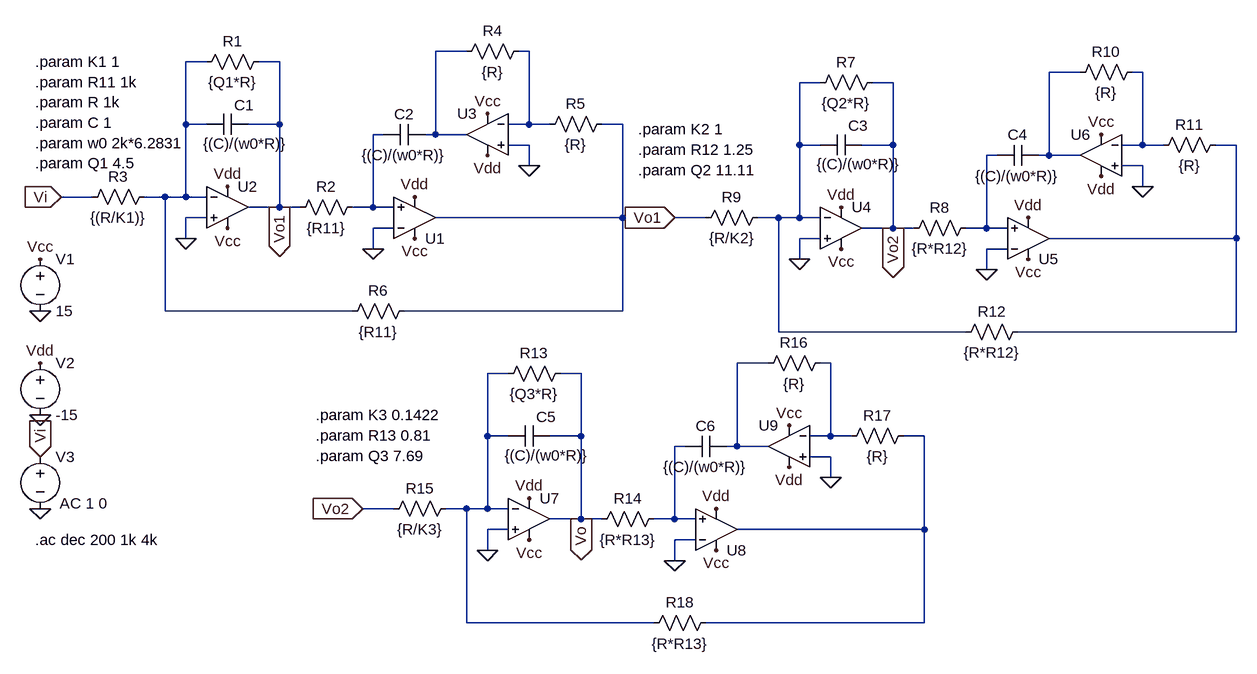
[diagram p0: schematic problema#2_9.asc]
problema#2_9.asc, the LTspice schematic file:
Version 4
SHEET 1 1264 1456
WIRE -512 -16 -560 -16
WIRE -416 -16 -432 -16
WIRE -912 0 -944 0
WIRE -800 0 -832 0
WIRE 432 16 384 16
WIRE 528 16 512 16
WIRE 32 32 0 32
WIRE 144 32 112 32
WIRE -944 96 -944 0
WIRE -912 96 -944 96
WIRE -800 96 -800 0
WIRE -800 96 -848 96
WIRE -416 96 -416 -16
WIRE -416 96 -448 96
WIRE -384 96 -416 96
WIRE -272 96 -304 96
WIRE -640 112 -656 112
WIRE -560 112 -560 -16
WIRE -560 112 -576 112
WIRE -512 112 -560 112
WIRE -416 128 -448 128
WIRE 0 128 0 32
WIRE 32 128 0 128
WIRE 144 128 144 32
WIRE 144 128 96 128
WIRE 528 128 528 16
WIRE 528 128 496 128
WIRE 560 128 528 128
WIRE 672 128 640 128
WIRE 304 144 288 144
WIRE 384 144 384 16
WIRE 384 144 368 144
WIRE 432 144 384 144
WIRE -416 160 -416 128
WIRE 528 160 496 160
WIRE 528 192 528 160
WIRE -1088 208 -1136 208
WIRE -976 208 -1008 208
WIRE -944 208 -944 96
WIRE -944 208 -976 208
WIRE -912 208 -944 208
WIRE -800 224 -800 96
WIRE -800 224 -848 224
WIRE -768 224 -800 224
WIRE -656 224 -656 112
WIRE -656 224 -688 224
WIRE -624 224 -656 224
WIRE -912 240 -944 240
WIRE -272 240 -272 96
WIRE -272 240 -560 240
WIRE -144 240 -192 240
WIRE -32 240 -64 240
WIRE 0 240 0 128
WIRE 0 240 -32 240
WIRE 32 240 0 240
WIRE -624 256 -656 256
WIRE 144 256 144 128
WIRE 144 256 96 256
WIRE 176 256 144 256
WIRE 288 256 288 144
WIRE 288 256 256 256
WIRE 320 256 288 256
WIRE -944 272 -944 240
WIRE 32 272 0 272
WIRE 672 272 672 128
WIRE 672 272 384 272
WIRE -656 288 -656 256
WIRE 320 288 288 288
WIRE 0 304 0 272
WIRE 288 320 288 288
WIRE -976 384 -976 208
WIRE -688 384 -976 384
WIRE -272 384 -272 240
WIRE -272 384 -608 384
WIRE -32 416 -32 240
WIRE 256 416 -32 416
WIRE 672 416 672 272
WIRE 672 416 336 416
WIRE -48 464 -96 464
WIRE 48 464 32 464
WIRE -448 480 -480 480
WIRE -336 480 -368 480
WIRE -480 576 -480 480
WIRE -448 576 -480 576
WIRE -336 576 -336 480
WIRE -336 576 -384 576
WIRE 48 576 48 464
WIRE 48 576 16 576
WIRE 80 576 48 576
WIRE 192 576 160 576
WIRE -176 592 -192 592
WIRE -96 592 -96 464
WIRE -96 592 -112 592
WIRE -48 592 -96 592
WIRE 48 608 16 608
WIRE 48 640 48 608
WIRE -624 688 -672 688
WIRE -512 688 -544 688
WIRE -480 688 -480 576
WIRE -480 688 -512 688
WIRE -448 688 -480 688
WIRE -336 704 -336 576
WIRE -336 704 -384 704
WIRE -304 704 -336 704
WIRE -192 704 -192 592
WIRE -192 704 -224 704
WIRE -160 704 -192 704
WIRE -448 720 -480 720
WIRE 192 720 192 576
WIRE 192 720 -96 720
WIRE -160 736 -192 736
WIRE -480 752 -480 720
WIRE -192 768 -192 736
WIRE -512 864 -512 688
WIRE -224 864 -512 864
WIRE 192 864 192 720
WIRE 192 864 -144 864
FLAG -1168 688 0
FLAG -1168 544 0
FLAG -1168 384 0
FLAG -1168 608 Vi
IOPIN -1168 608 In
FLAG -1136 208 Vi
IOPIN -1136 208 In
FLAG -1168 304 Vcc
FLAG -880 256 Vcc
FLAG -1168 464 Vdd
FLAG -880 192 Vdd
FLAG -800 224 Vo1
IOPIN -800 224 Out
FLAG -592 208 Vdd
FLAG -592 272 Vcc
FLAG -944 272 0
FLAG -656 288 0
FLAG -480 80 Vcc
FLAG -480 144 Vdd
FLAG -416 160 0
FLAG -192 240 Vo1
IOPIN -192 240 In
FLAG 64 288 Vcc
FLAG 64 224 Vdd
FLAG 144 256 Vo2
IOPIN 144 256 Out
FLAG 352 240 Vdd
FLAG 352 304 Vcc
FLAG 0 304 0
FLAG 288 320 0
FLAG 464 112 Vcc
FLAG 464 176 Vdd
FLAG 528 192 0
FLAG -672 688 Vo2
IOPIN -672 688 In
FLAG -416 736 Vcc
FLAG -416 672 Vdd
FLAG -336 704 Vo
IOPIN -336 704 Out
FLAG -128 688 Vdd
FLAG -128 752 Vcc
FLAG -480 752 0
FLAG -192 768 0
FLAG -16 560 Vcc
FLAG -16 624 Vdd
FLAG 48 640 0
SYMBOL Opamps\\UniversalOpamp2 -880 224 R0
SYMATTR InstName U2
SYMBOL voltage -1168 288 R0
WINDOW 123 0 0 Left 2
WINDOW 39 0 0 Left 2
SYMATTR InstName V1
SYMATTR Value 15
SYMBOL voltage -1168 448 R0
WINDOW 123 0 0 Left 2
WINDOW 39 0 0 Left 2
SYMATTR InstName V2
SYMATTR Value -15
SYMBOL voltage -1168 592 R0
WINDOW 123 30 88 Left 2
WINDOW 39 0 0 Left 2
SYMATTR Value2 AC 1 0
SYMATTR InstName V3
SYMATTR Value ""
SYMBOL cap -848 80 R90
WINDOW 0 2 6 VBottom 2
WINDOW 3 30 4 VTop 2
SYMATTR InstName C1
SYMATTR Value {(C)/(w0*R)}
SYMBOL res -816 -16 R90
WINDOW 0 0 56 VBottom 2
WINDOW 3 32 56 VTop 2
SYMATTR InstName R1
SYMATTR Value {Q1*R}
SYMBOL res -672 208 R90
WINDOW 0 0 56 VBottom 2
WINDOW 3 32 56 VTop 2
SYMATTR InstName R2
SYMATTR Value {R11}
SYMBOL res -992 192 R90
WINDOW 0 0 56 VBottom 2
WINDOW 3 32 56 VTop 2
SYMATTR InstName R3
SYMATTR Value {(R/K1)}
SYMBOL Opamps\\UniversalOpamp2 -592 240 M180
SYMATTR InstName U1
SYMBOL Opamps\\UniversalOpamp2 -480 112 M0
SYMATTR InstName U3
SYMBOL cap -576 96 R90
WINDOW 0 0 32 VBottom 2
WINDOW 3 32 32 VTop 2
SYMATTR InstName C2
SYMATTR Value {(C)/(w0*R)}
SYMBOL res -416 -32 R90
WINDOW 0 0 56 VBottom 2
WINDOW 3 32 56 VTop 2
SYMATTR InstName R4
SYMATTR Value {R}
SYMBOL res -288 80 R90
WINDOW 0 0 56 VBottom 2
WINDOW 3 32 56 VTop 2
SYMATTR InstName R5
SYMATTR Value {R}
SYMBOL res -592 368 R90
WINDOW 0 0 56 VBottom 2
WINDOW 3 32 56 VTop 2
SYMATTR InstName R6
SYMATTR Value {R11}
SYMBOL Opamps\\UniversalOpamp2 64 256 R0
SYMATTR InstName U4
SYMBOL cap 96 112 R90
WINDOW 0 2 6 VBottom 2
WINDOW 3 30 4 VTop 2
SYMATTR InstName C3
SYMATTR Value {(C)/(w0*R)}
SYMBOL res 128 16 R90
WINDOW 0 0 56 VBottom 2
WINDOW 3 32 56 VTop 2
SYMATTR InstName R7
SYMATTR Value {Q2*R}
SYMBOL res 272 240 R90
WINDOW 0 0 56 VBottom 2
WINDOW 3 32 56 VTop 2
SYMATTR InstName R8
SYMATTR Value {R*R12}
SYMBOL res -48 224 R90
WINDOW 0 0 56 VBottom 2
WINDOW 3 32 56 VTop 2
SYMATTR InstName R9
SYMATTR Value {R/K2}
SYMBOL Opamps\\UniversalOpamp2 352 272 M180
SYMATTR InstName U5
SYMBOL Opamps\\UniversalOpamp2 464 144 M0
SYMATTR InstName U6
SYMBOL cap 368 128 R90
WINDOW 0 0 32 VBottom 2
WINDOW 3 32 32 VTop 2
SYMATTR InstName C4
SYMATTR Value {(C)/(w0*R)}
SYMBOL res 528 0 R90
WINDOW 0 0 56 VBottom 2
WINDOW 3 32 56 VTop 2
SYMATTR InstName R10
SYMATTR Value {R}
SYMBOL res 656 112 R90
WINDOW 0 0 56 VBottom 2
WINDOW 3 32 56 VTop 2
SYMATTR InstName R11
SYMATTR Value {R}
SYMBOL res 352 400 R90
WINDOW 0 0 56 VBottom 2
WINDOW 3 32 56 VTop 2
SYMATTR InstName R12
SYMATTR Value {R*R12}
SYMBOL Opamps\\UniversalOpamp2 -416 704 R0
SYMATTR InstName U7
SYMBOL cap -384 560 R90
WINDOW 0 2 6 VBottom 2
WINDOW 3 30 4 VTop 2
SYMATTR InstName C5
SYMATTR Value {(C)/(w0*R)}
SYMBOL res -352 464 R90
WINDOW 0 0 56 VBottom 2
WINDOW 3 32 56 VTop 2
SYMATTR InstName R13
SYMATTR Value {Q3*R}
SYMBOL res -208 688 R90
WINDOW 0 0 56 VBottom 2
WINDOW 3 32 56 VTop 2
SYMATTR InstName R14
SYMATTR Value {R*R13}
SYMBOL res -528 672 R90
WINDOW 0 0 56 VBottom 2
WINDOW 3 32 56 VTop 2
SYMATTR InstName R15
SYMATTR Value {R/K3}
SYMBOL Opamps\\UniversalOpamp2 -128 720 M180
SYMATTR InstName U8
SYMBOL Opamps\\UniversalOpamp2 -16 592 M0
SYMATTR InstName U9
SYMBOL cap -112 576 R90
WINDOW 0 0 32 VBottom 2
WINDOW 3 32 32 VTop 2
SYMATTR InstName C6
SYMATTR Value {(C)/(w0*R)}
SYMBOL res 48 448 R90
WINDOW 0 0 56 VBottom 2
WINDOW 3 32 56 VTop 2
SYMATTR InstName R16
SYMATTR Value {R}
SYMBOL res 176 560 R90
WINDOW 0 0 56 VBottom 2
WINDOW 3 32 56 VTop 2
SYMATTR InstName R17
SYMATTR Value {R}
SYMBOL res -128 848 R90
WINDOW 0 0 56 VBottom 2
WINDOW 3 32 56 VTop 2
SYMATTR InstName R18
SYMATTR Value {R*R13}
TEXT -1176 736 Left 2 !.ac dec 200 1k 4k
TEXT -1176 0 Left 2 !.param K1 1\n.param R11 1k\n.param R 1k\n.param C 1\n.param w0 2k*6.2831\n.param Q1 4.5
TEXT -248 104 Left 2 !.param K2 1\n.param R12 1.25\n.param Q2 11.11
TEXT -744 544 Left 2 !.param K3 0.1422\n.param R13 0.81\n.param Q3 7.69

The netlist it stands for:
* problema#2_9.asc
XU2 0 N003 Vdd Vcc Vo1 level.2 Avol=1Meg GBW=10Meg Slew=10Meg ilimit=25m rail=0 Vos=0 phimargin=45 en=0 enk=0 in=0 ink=0 Rin=500Meg  ; pins IN+ IN- V+ V- OUT
V1 Vcc 0 15
V2 Vdd 0 -15
V3 Vi 0 AC 1 0
C1 Vo1 N003 {(C)/(w0*R)}
R1 Vo1 N003 {Q1*R}
R2 N008 Vo1 {R11}
R3 N003 Vi {(R/K1)}
XU1 N008 0 Vcc Vdd N007 level.2 Avol=1Meg GBW=10Meg Slew=10Meg ilimit=25m rail=0 Vos=0 phimargin=45 en=0 enk=0 in=0 ink=0 Rin=500Meg  ; pins IN+ IN- V+ V- OUT
XU3 0 N002 Vcc Vdd N001 level.2 Avol=1Meg GBW=10Meg Slew=10Meg ilimit=25m rail=0 Vos=0 phimargin=45 en=0 enk=0 in=0 ink=0 Rin=500Meg  ; pins IN+ IN- V+ V- OUT
C2 N001 N008 {(C)/(w0*R)}
R4 N002 N001 {R}
R5 N007 N002 {R}
R6 N007 N003 {R11}
XU4 0 N006 Vdd Vcc Vo2 level.2 Avol=1Meg GBW=10Meg Slew=10Meg ilimit=25m rail=0 Vos=0 phimargin=45 en=0 enk=0 in=0 ink=0 Rin=500Meg  ; pins IN+ IN- V+ V- OUT
C3 Vo2 N006 {(C)/(w0*R)}
R7 Vo2 N006 {Q2*R}
R8 N010 Vo2 {R*R12}
R9 N006 Vo1 {R/K2}
XU5 N010 0 Vcc Vdd N009 level.2 Avol=1Meg GBW=10Meg Slew=10Meg ilimit=25m rail=0 Vos=0 phimargin=45 en=0 enk=0 in=0 ink=0 Rin=500Meg  ; pins IN+ IN- V+ V- OUT
XU6 0 N005 Vcc Vdd N004 level.2 Avol=1Meg GBW=10Meg Slew=10Meg ilimit=25m rail=0 Vos=0 phimargin=45 en=0 enk=0 in=0 ink=0 Rin=500Meg  ; pins IN+ IN- V+ V- OUT
C4 N004 N010 {(C)/(w0*R)}
R10 N005 N004 {R}
R11 N009 N005 {R}
R12 N009 N006 {R*R12}
XU7 0 N013 Vdd Vcc Vo level.2 Avol=1Meg GBW=10Meg Slew=10Meg ilimit=25m rail=0 Vos=0 phimargin=45 en=0 enk=0 in=0 ink=0 Rin=500Meg  ; pins IN+ IN- V+ V- OUT
C5 Vo N013 {(C)/(w0*R)}
R13 Vo N013 {Q3*R}
R14 N015 Vo {R*R13}
R15 N013 Vo2 {R/K3}
XU8 N015 0 Vcc Vdd N014 level.2 Avol=1Meg GBW=10Meg Slew=10Meg ilimit=25m rail=0 Vos=0 phimargin=45 en=0 enk=0 in=0 ink=0 Rin=500Meg  ; pins IN+ IN- V+ V- OUT
XU9 0 N012 Vcc Vdd N011 level.2 Avol=1Meg GBW=10Meg Slew=10Meg ilimit=25m rail=0 Vos=0 phimargin=45 en=0 enk=0 in=0 ink=0 Rin=500Meg  ; pins IN+ IN- V+ V- OUT
C6 N011 N015 {(C)/(w0*R)}
R16 N012 N011 {R}
R17 N014 N012 {R}
R18 N014 N013 {R*R13}
.ac dec 200 1k 4k
.param K1 1
.param R11 1k
.param R 1k
.param C 1
.param w0 2k*6.2831
.param Q1 4.5
.param K2 1
.param R12 1.25
.param Q2 11.11
.param K3 0.1422
.param R13 0.81
.param Q3 7.69
.lib UniversalOpamps2.sub
.backanno
.end